# EAGLE schematic MAX4466v1 (EAGLE 5.06)
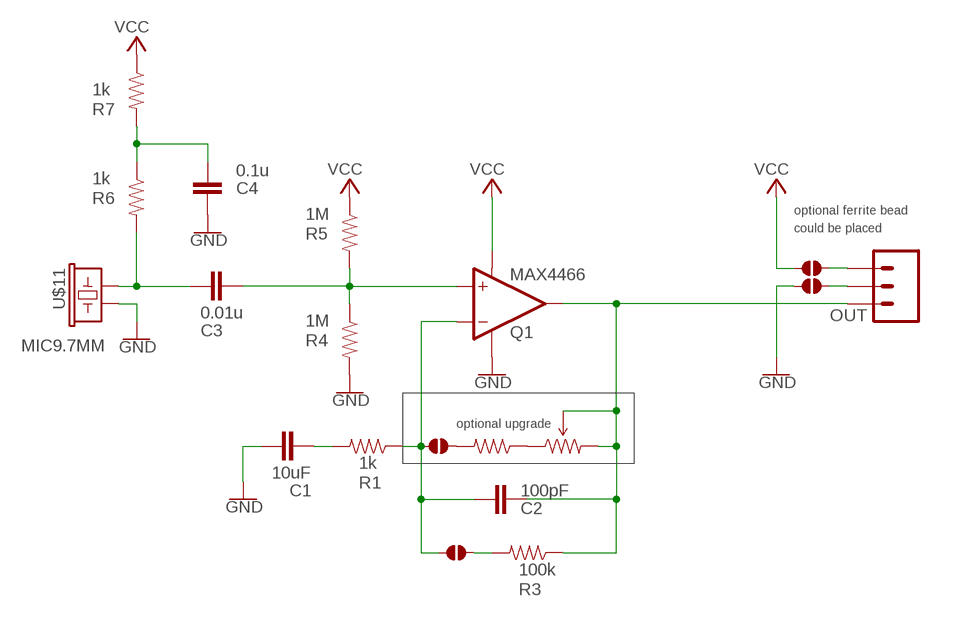
[diagram p0: schematic, sheet 1]

## Parts
C1  10uF  CAP0603-CAP  [0603-CAP]
C2  100pF  CAP0603-CAP  [0603-CAP]
C3  0.01u  CAP0603-CAP  [0603-CAP]
C4  0.1u  CAP0603-CAP  [0603-CAP]
FB1  0603-JUMPER  [0603-JUMPER]
FB2  0603-JUMPER  [0603-JUMPER]
J1  M03  [M03]
Q1  MAX4466  [SC70]
R1  1k  RESISTOR0603-RES  [0603-RES]
R2  22  RESISTOR0603-RES  [0603-RES]
R3  100k  RESISTOR0603-RES  [0603-RES]
R4  1M  RESISTOR0603-RES  [0603-RES]
R5  1M  RESISTOR0603-RES  [0603-RES]
R6  1k  RESISTOR0603-RES  [0603-RES]
R7  1k  RESISTOR0603-RES  [0603-RES]
S1  SOLDERJUMPER-NC  [SOLDE-JUMPER-NC]
U$8  SOLDERJUMPER  [SOLDER-JUMPER]
U$11  MIC9.7MM  [MIC-9.7MM]
VR1  100k  TRIMPOT  [TRIMPOT]

## Nets
GND: C1.1 C4.2 FB2.1 Q1.2(GND) R4.2 U$11.2
N$1: FB1.2 J1.1
N$2: FB2.2 J1.2
N$3: C2.1 Q1.3(-) R1.1 S1.3 U$8.P$1
N$4: C1.2 R1.2
N$5: R2.1 VR1.3(CCW)
N$6: R2.2 U$8.P$2
N$7: R3.2 S1.4
N$8: C4.1 R6.1 R7.2
N$9: C3.2 Q1.1(+) R4.1 R5.2
N$10: C3.1 R6.2 U$11.1
OUT: C2.2 J1.3 Q1.4(OUT) R3.1 VR1.1(CW) VR1.2(WIPER)
VCC: FB1.1 Q1.5(VCC) R5.1 R7.1

## Notes on the sheet
- optional ferrite bead
- could be placed
- optional upgrade

## Library data of the parts
C1-C4 = SparkFun:CAP: Capacitor Standard 0603 ceramic capacitor, and 0.1" leaded capacitor.
FB1 FB2 = Travis:0603-JUMPER
J1 = Travis:M03
Q1 = Travis:MAX4466
R1-R7 = SparkFun:RESISTOR: Resistor Basic schematic elements and footprints for 0603, 1206, and PTH resistors.
S1 = Travis:SOLDERJUMPER-NC
U$8 = Travis:SOLDERJUMPER
U$11 = SparkFun:MIC: Microphone Omni-directional electret microphone. 9.7mm standard diameter.
VR1 = Travis:TRIMPOT